# EAGLE schematic schaltplan_v3 (EAGLE 9.7.0)
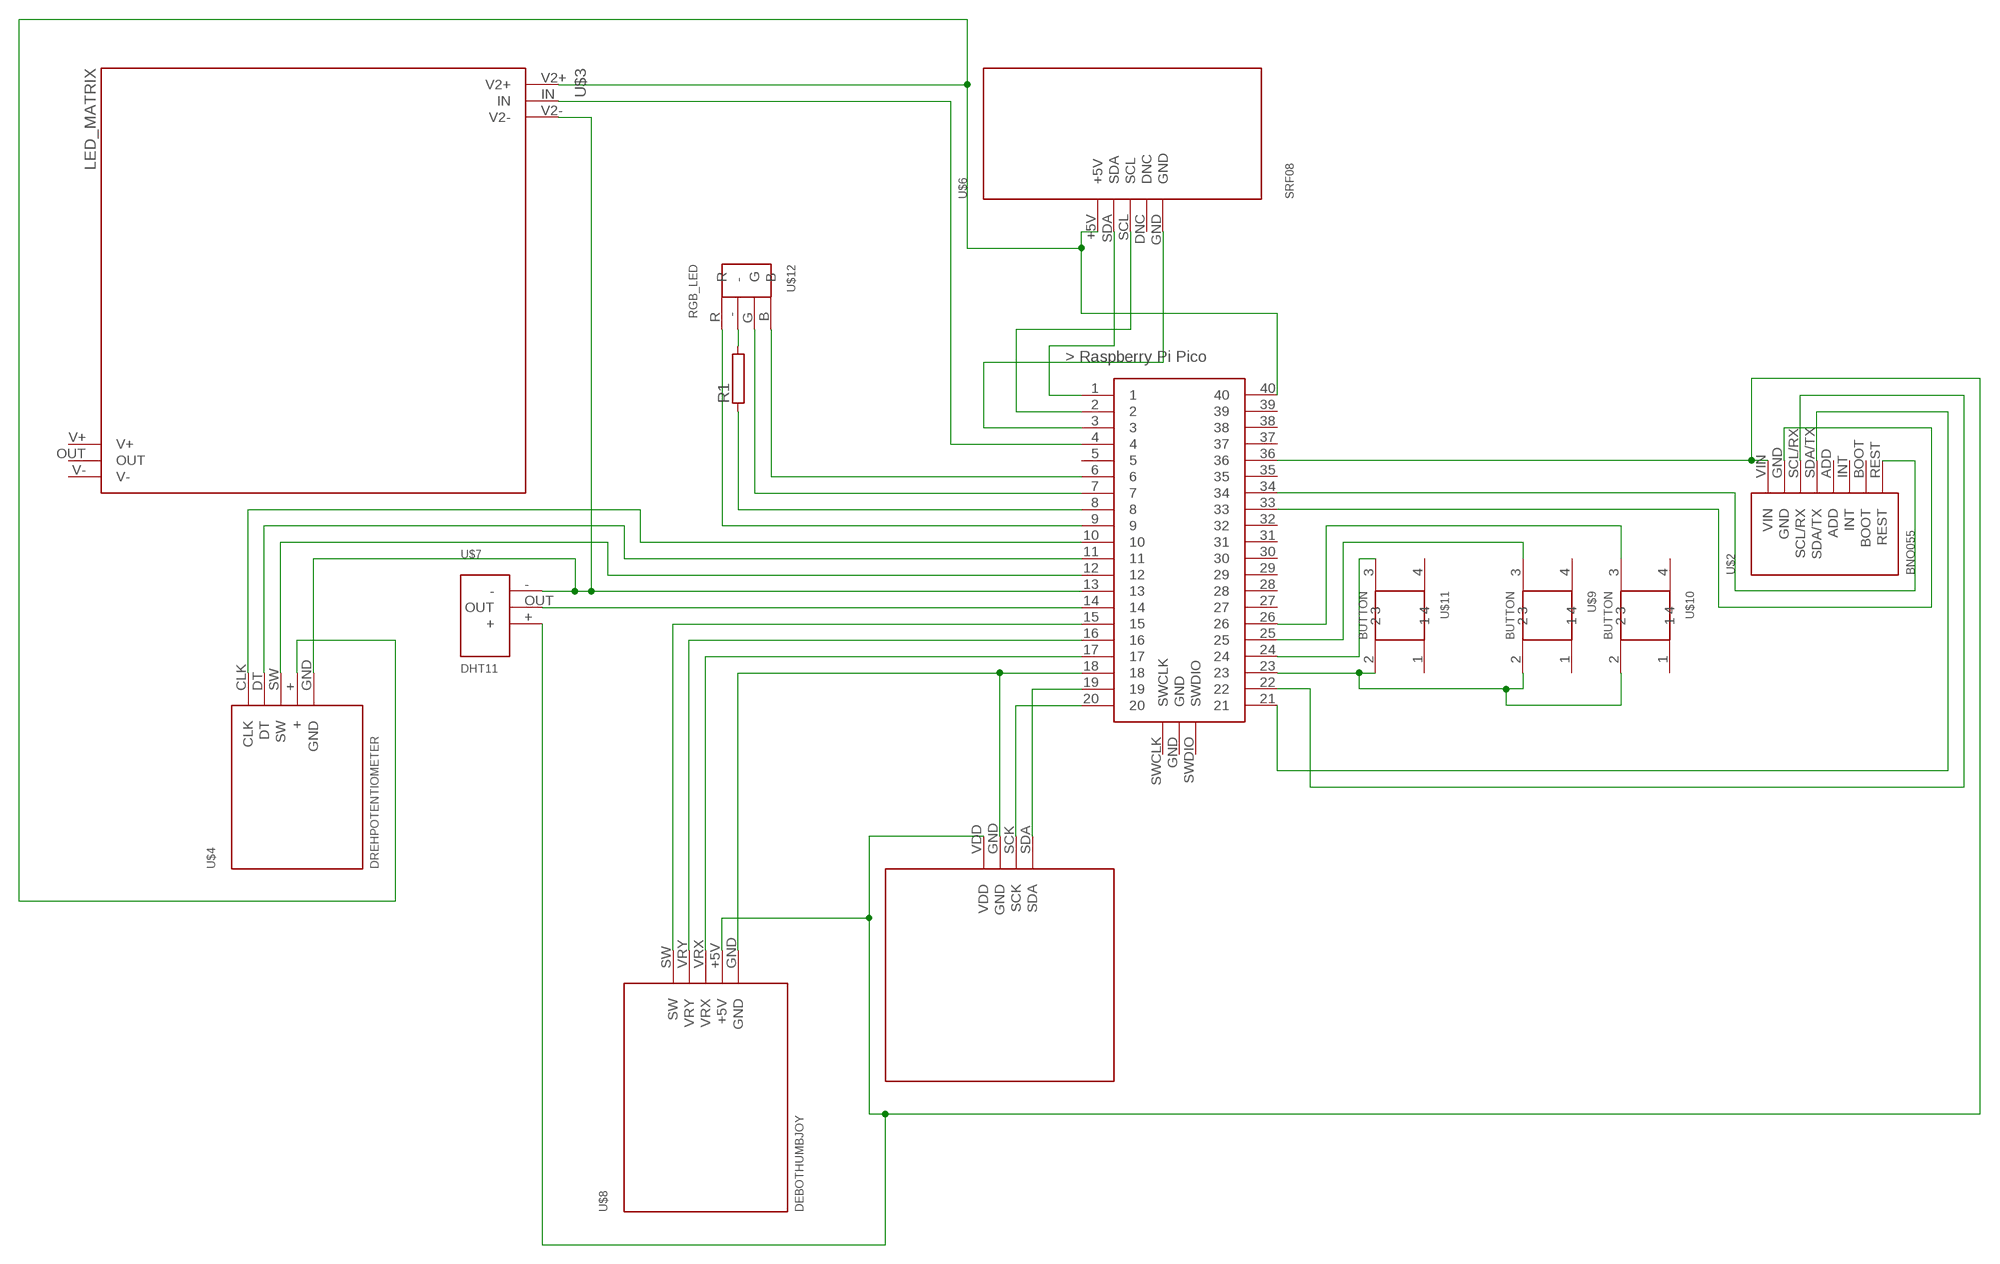
[diagram p0: schematic, sheet 1]

## Parts
R1  RAC01  [AC01]
U$1  RASPBERRY-PI-PICO_TH  [FT_RASPBERRY-PI-PICO_TH]
U$2  BNO055  [BNO055]
U$3  LED_MATRIX  [LED_MATRIX]
U$4  DREHPOTENTIOMETER  [DREHPOTENTIOMETER]
U$5  OLED_DISPLAY  [OLED_DISPLAY]
U$6  SRF08  [SRF08]
U$7  DHT11  [DHT11]
U$8  DEBOTHUMBJOY  [DEBOTHUMBJOY]
U$9  BUTTON  [BUTTON]
U$10  BUTTON  [BUTTON]
U$11  BUTTON  [BUTTON]
U$12  RGB_LED  [RGB_LED]

## Nets
N$1: U$1.36 U$2.VIN U$5.VDD U$7.+ U$8.+5V
N$2: U$1.20 U$5.SCK
N$3: U$1.22 U$2.SCL/RX
N$4: U$1.21 U$2.SDA/TX
N$5: U$1.34 U$2.REST
N$6: U$1.33 U$2.GND
N$7: U$1.19 U$5.SDA
N$8: U$1.18 U$5.GND U$8.GND
N$9: U$1.40 U$3.V2+ U$4.+ U$6.+5V
N$10: U$1.3 U$6.GND
N$11: U$1.1 U$6.SDA
N$12: U$1.2 U$6.SCL
N$13: U$1.17 U$8.VRX
N$14: U$1.16 U$8.VRY
N$15: U$1.15 U$8.SW
N$16: U$1.14 U$7.OUT
N$17: U$1.13 U$3.V2- U$4.GND U$7.-
N$18: U$1.12 U$4.SW
N$19: U$1.4 U$3.IN
N$20: U$1.11 U$4.DT
N$21: U$1.10 U$4.CLK
N$22: R1.2 U$12.-
N$23: R1.1 U$1.8
N$24: U$1.9 U$12.R
N$25: U$1.7 U$12.G
N$26: U$1.6 U$12.B
N$27: U$1.24 U$11.3
N$28: U$1.23 U$9.2 U$10.2 U$11.2
N$29: U$1.25 U$9.3
N$30: U$1.26 U$10.3
Unconnected: U$1.5 U$1.27 U$1.28 U$1.29 U$1.30 U$1.31 U$1.32 U$1.35 U$1.37 U$1.38 U$1.39 U$1.GND U$1.SWCLK U$1.SWDIO U$2.ADD U$2.BOOT U$2.INT U$3.OUT U$3.V+ U$3.V- U$6.DNC U$9.1 U$9.4 U$10.1 U$10.4 U$11.1 U$11.4

## Library data of the parts
R1 = resistor-power:R: Power Resitor; OC_FARNELL: unknown; OC_NEWARK: unknown
U$1 = pipico:RASPBERRY-PI-PICO_TH: Raspberry Pi Pico microcontroller board for through-hole mounting.
U$2 = fehlendeTeile:BNO055
U$3 = fehlendeTeile:LED_MATRIX
U$4 = fehlendeTeile:DREHPOTENTIOMETER
U$5 = fehlendeTeile:OLED_DISPLAY
U$6 = fehlendeTeile:SRF08
U$7 = fehlendeTeile:DHT11
U$8 = fehlendeTeile:DEBOTHUMBJOY
U$9-U$11 = fehlendeTeile:BUTTON
U$12 = fehlendeTeile:RGB_LED